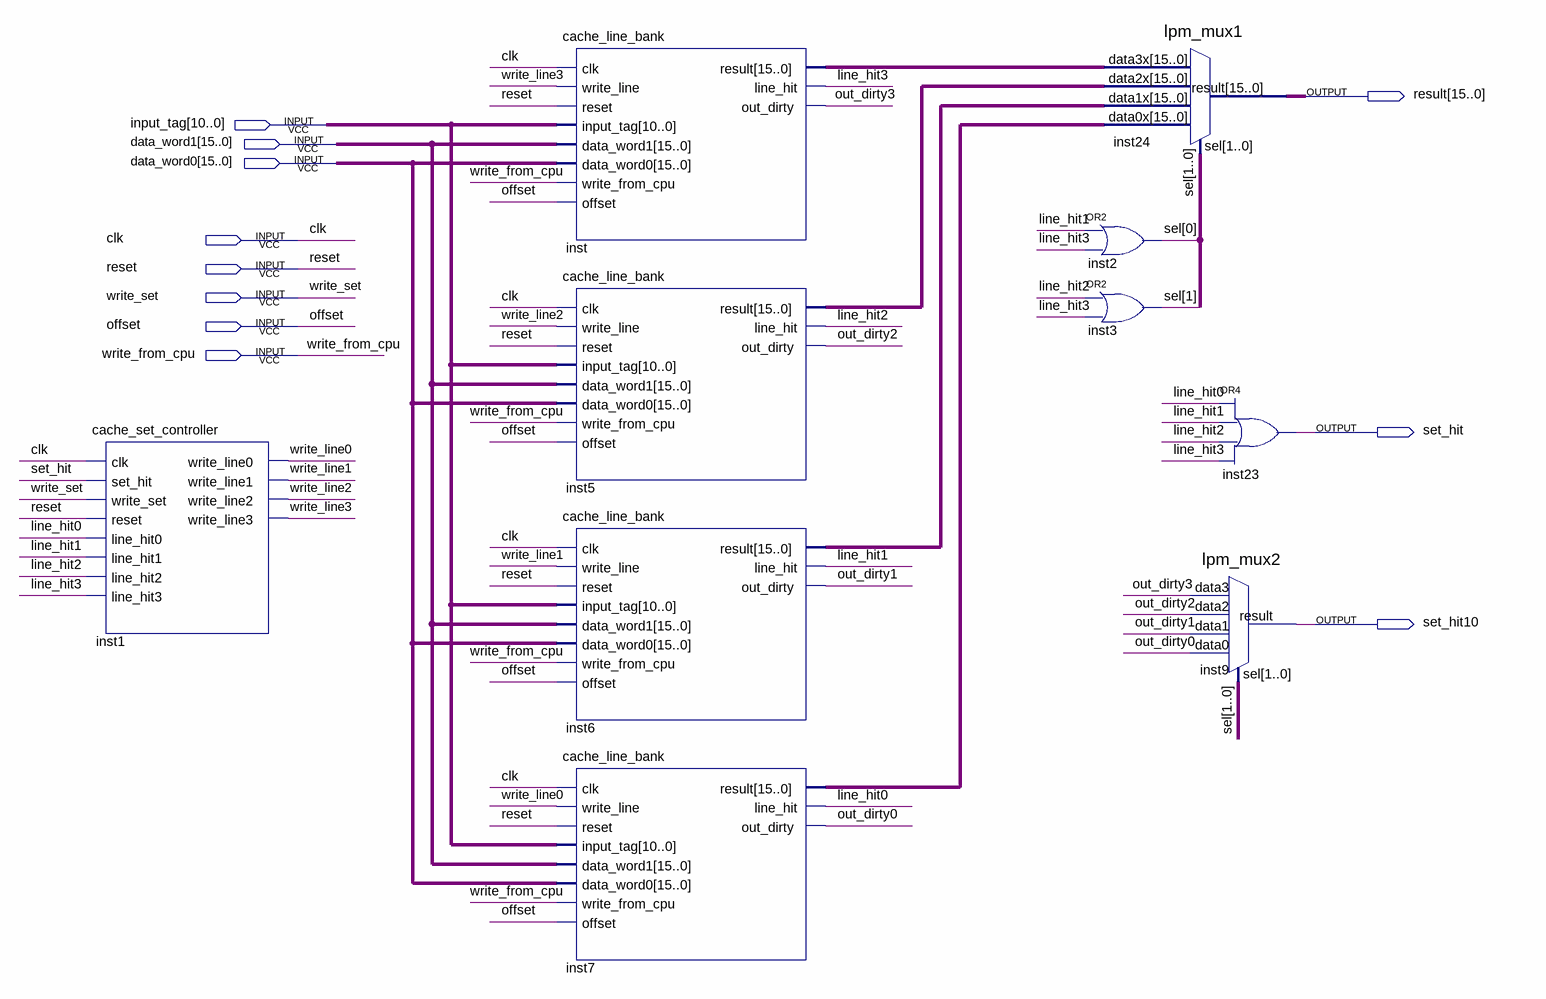
[diagram p0: schematic sheet]
// Quartus schematic cache_set_4_way.bdf as structural Verilog: 10 symbols, 11 pins
module cache_set_4_way (
  input  [10:0] input_tag,
  input  [15:0] data_word1,
  input  [15:0] data_word0,
  input  clk,
  input  reset,
  input  write_set,
  input  offset,
  input  write_from_cpu,
  output [15:0] result,
  output set_hit,
  output set_hit10
);

  wire line_hit0, line_hit1, line_hit2, line_hit3, out_dirty0, out_dirty1, out_dirty2, out_dirty3,
       write_line0, write_line1, write_line2, write_line3;
  wire [1:0] sel;
  wire [15:0] inst5_result, inst6_result, inst7_result, inst_result;

  cache_set_controller inst1 (
    .clk(clk), .set_hit(set_hit), .write_set(write_set), .reset(reset), .line_hit0(line_hit0),
    .line_hit1(line_hit1), .line_hit2(line_hit2), .line_hit3(line_hit3), .write_line0(write_line0),
    .write_line1(write_line1), .write_line2(write_line2), .write_line3(write_line3));
  cache_line_bank inst (
    .clk(clk), .write_line(write_line3), .reset(reset), .input_tag(input_tag), .data_word1(data_word1),
    .data_word0(data_word0), .write_from_cpu(write_from_cpu), .offset(offset), .result(inst_result),
    .line_hit(line_hit3), .out_dirty(out_dirty3));
  cache_line_bank inst5 (
    .clk(clk), .write_line(write_line2), .reset(reset), .input_tag(input_tag), .data_word1(data_word1),
    .data_word0(data_word0), .write_from_cpu(write_from_cpu), .offset(offset), .result(inst5_result),
    .line_hit(line_hit2), .out_dirty(out_dirty2));
  cache_line_bank inst6 (
    .clk(clk), .write_line(write_line1), .reset(reset), .input_tag(input_tag), .data_word1(data_word1),
    .data_word0(data_word0), .write_from_cpu(write_from_cpu), .offset(offset), .result(inst6_result),
    .line_hit(line_hit1), .out_dirty(out_dirty1));
  cache_line_bank inst7 (
    .clk(clk), .write_line(write_line0), .reset(reset), .input_tag(input_tag), .data_word1(data_word1),
    .data_word0(data_word0), .write_from_cpu(write_from_cpu), .offset(offset), .result(inst7_result),
    .line_hit(line_hit0), .out_dirty(out_dirty0));
  or inst2 (sel[0], line_hit1, line_hit3);
  or inst3 (sel[1], line_hit2, line_hit3);
  lpm_mux1 inst24 (
    .data3x(inst_result), .data2x(inst5_result), .data1x(inst6_result), .data0x(inst7_result), .sel(sel),
    .result(result));
  or inst23 (set_hit, line_hit0, line_hit1, line_hit2, line_hit3);
  lpm_mux2 inst9 (
    .data3(out_dirty3), .data2(out_dirty2), .data1(out_dirty1), .data0(out_dirty0), .sel(sel),
    .result(set_hit10));
endmodule
